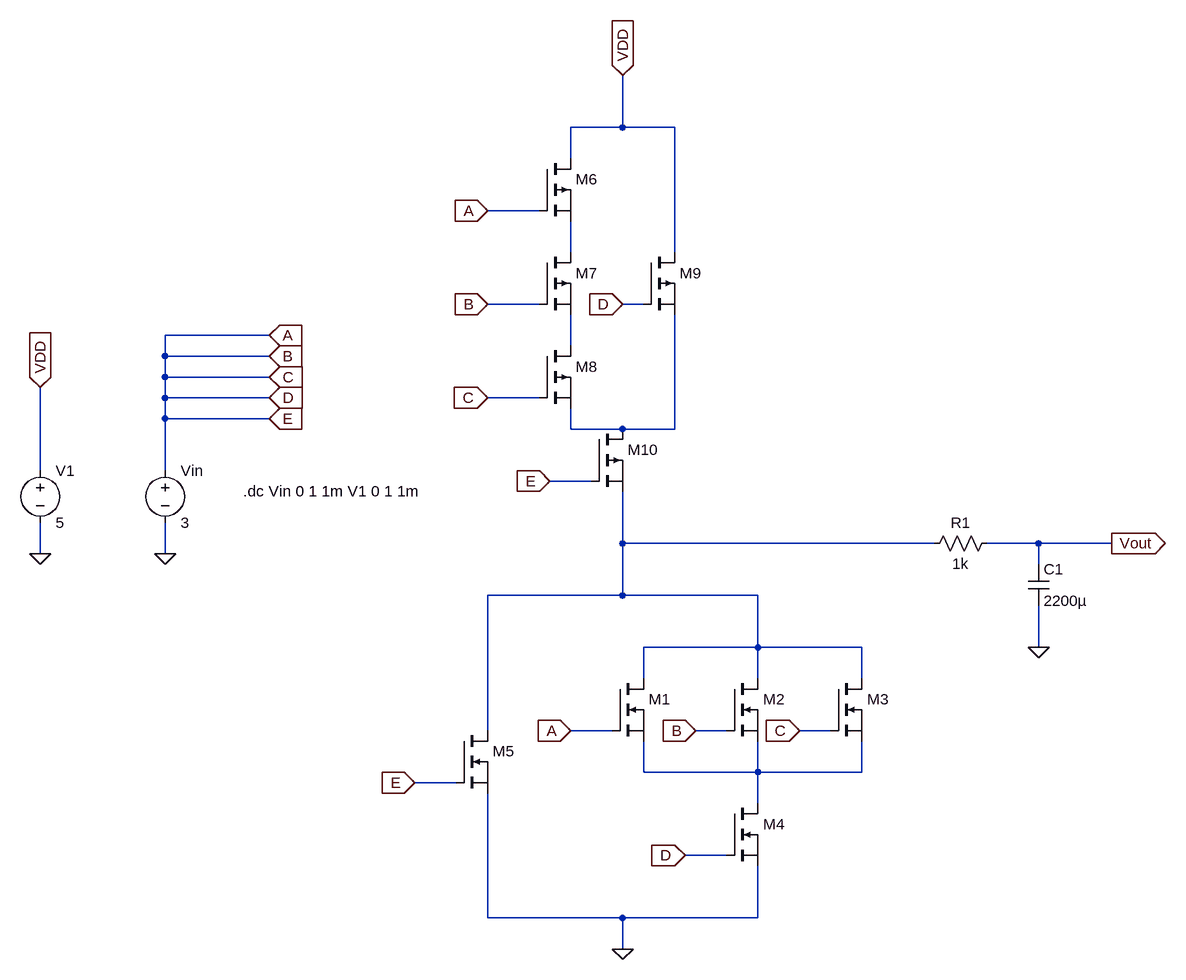
[diagram p0: schematic NonStandartInverter.asc]
NonStandartInverter.asc, the LTspice schematic file:
Version 4
SHEET 1 1024 680
WIRE 128 -1184 128 -1264
WIRE 128 -1184 48 -1184
WIRE 208 -1184 128 -1184
WIRE 48 -1136 48 -1184
WIRE 0 -1056 -80 -1056
WIRE 48 -992 48 -1040
WIRE 208 -992 208 -1184
WIRE 0 -912 -80 -912
WIRE 160 -912 128 -912
WIRE -416 -864 -576 -864
WIRE 48 -848 48 -896
WIRE -576 -832 -576 -864
WIRE -416 -832 -576 -832
WIRE -576 -800 -576 -832
WIRE -416 -800 -576 -800
WIRE -576 -768 -576 -800
WIRE -416 -768 -576 -768
WIRE 0 -768 -80 -768
WIRE -576 -736 -576 -768
WIRE -416 -736 -576 -736
WIRE 48 -720 48 -752
WIRE 128 -720 48 -720
WIRE 208 -720 208 -896
WIRE 208 -720 128 -720
WIRE -768 -656 -768 -784
WIRE -576 -656 -576 -736
WIRE 80 -640 16 -640
WIRE 128 -544 128 -624
WIRE 608 -544 128 -544
WIRE 768 -544 688 -544
WIRE 880 -544 768 -544
WIRE -768 -528 -768 -576
WIRE -576 -528 -576 -576
WIRE 768 -512 768 -544
WIRE 128 -464 128 -544
WIRE 128 -464 -80 -464
WIRE 336 -464 128 -464
WIRE 336 -384 336 -464
WIRE 336 -384 160 -384
WIRE 496 -384 336 -384
WIRE 768 -384 768 -448
WIRE 160 -336 160 -384
WIRE 336 -336 336 -384
WIRE 496 -336 496 -384
WIRE -80 -256 -80 -464
WIRE 112 -256 48 -256
WIRE 288 -256 240 -256
WIRE 448 -256 400 -256
WIRE 160 -192 160 -240
WIRE 336 -192 336 -240
WIRE 336 -192 160 -192
WIRE 496 -192 496 -240
WIRE 496 -192 336 -192
WIRE -128 -176 -192 -176
WIRE 336 -144 336 -192
WIRE 288 -64 224 -64
WIRE -80 32 -80 -160
WIRE 128 32 -80 32
WIRE 336 32 336 -48
WIRE 336 32 128 32
WIRE 128 80 128 32
FLAG 128 80 0
FLAG -80 -1056 A
IOPIN -80 -1056 In
FLAG -80 -912 B
IOPIN -80 -912 In
FLAG -80 -768 C
IOPIN -80 -768 In
FLAG 128 -912 D
IOPIN 128 -912 In
FLAG 16 -640 E
IOPIN 16 -640 In
FLAG -192 -176 E
IOPIN -192 -176 In
FLAG 48 -256 A
IOPIN 48 -256 In
FLAG 240 -256 B
IOPIN 240 -256 In
FLAG 400 -256 C
IOPIN 400 -256 In
FLAG 224 -64 D
IOPIN 224 -64 In
FLAG 128 -1264 VDD
IOPIN 128 -1264 In
FLAG 880 -544 Vout
IOPIN 880 -544 Out
FLAG 768 -384 0
FLAG -416 -864 A
IOPIN -416 -864 In
FLAG -416 -832 B
IOPIN -416 -832 In
FLAG -416 -800 C
IOPIN -416 -800 In
FLAG -416 -768 D
IOPIN -416 -768 In
FLAG -416 -736 E
IOPIN -416 -736 In
FLAG -576 -528 0
FLAG -768 -784 VDD
IOPIN -768 -784 In
FLAG -768 -528 0
SYMBOL nmos 112 -336 R0
WINDOW 3 56 72 Invisible 2
SYMATTR Value FDS4559_N
SYMATTR InstName M1
SYMBOL nmos 288 -336 R0
WINDOW 3 56 72 Invisible 2
SYMATTR Value FDS4559_N
SYMATTR InstName M2
SYMBOL nmos 448 -336 R0
WINDOW 3 56 72 Invisible 2
SYMATTR Value FDS4559_N
SYMATTR InstName M3
SYMBOL nmos 288 -144 R0
WINDOW 3 56 72 Invisible 2
SYMATTR Value FDS4559_N
SYMATTR InstName M4
SYMBOL nmos -128 -256 R0
WINDOW 3 56 72 Invisible 2
SYMATTR Value FDS4559_N
SYMATTR InstName M5
SYMBOL pmos 0 -1136 R0
WINDOW 3 56 72 Invisible 2
SYMATTR Value FDS4559_P
SYMATTR InstName M6
SYMBOL pmos 0 -992 R0
WINDOW 3 56 72 Invisible 2
SYMATTR Value FDS4559_P
SYMATTR InstName M7
SYMBOL pmos 0 -848 R0
WINDOW 3 56 72 Invisible 2
SYMATTR Value FDS4559_P
SYMATTR InstName M8
SYMBOL pmos 160 -992 R0
WINDOW 3 56 72 Invisible 2
SYMATTR Value FDS4559_P
SYMATTR InstName M9
SYMBOL pmos 80 -720 R0
WINDOW 3 56 72 Invisible 2
SYMATTR Value FDS4559_P
SYMATTR InstName M10
SYMBOL cap 752 -512 R0
SYMATTR InstName C1
SYMATTR Value 2200µ
SYMBOL res 704 -560 R90
WINDOW 0 0 56 VBottom 2
WINDOW 3 32 56 VTop 2
SYMATTR InstName R1
SYMATTR Value 1k
SYMBOL voltage -576 -672 R0
SYMATTR InstName Vin
SYMATTR Value 3
SYMBOL voltage -768 -672 R0
SYMATTR InstName V1
SYMATTR Value 5
TEXT -456 -624 Left 2 !.dc Vin 0 1 1m V1 0 1 1m

The netlist it stands for:
* NonStandartInverter.asc
M1 N004 E N005 N005 FDS4559_N
M2 N004 E N005 N005 FDS4559_N
M3 N004 E N005 N005 FDS4559_N
M4 N005 E 0 0 FDS4559_N
M5 N004 E 0 0 FDS4559_N
M6 VDD E N001 N001 FDS4559_P
M7 N001 E N002 N002 FDS4559_P
M8 N002 E N003 N003 FDS4559_P
M9 VDD E N003 N003 FDS4559_P
M10 N003 E N004 N004 FDS4559_P
C1 Vout 0 2200µ
R1 Vout N004 1k
Vin E 0 3
V1 VDD 0 5
.model NMOS NMOS
.model PMOS PMOS
.lib standard.mos
.dc Vin 0 1 1m V1 0 1 1m
.backanno
.end